# Altium project ALICE.PrjPCB
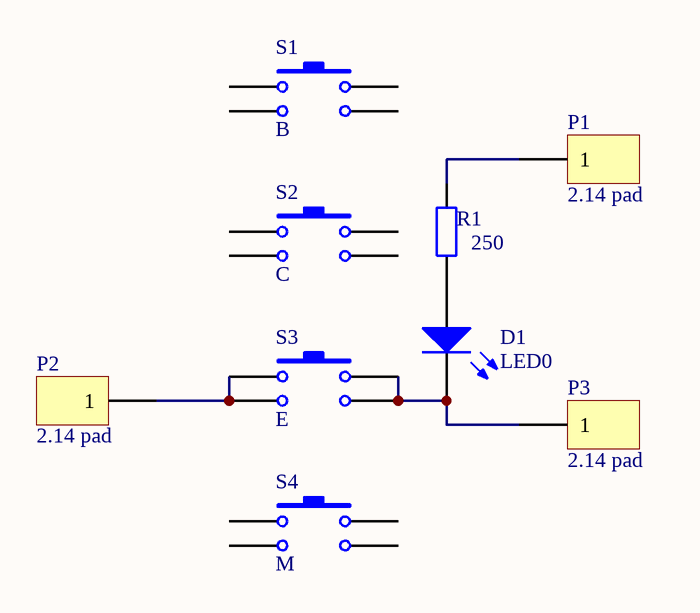
[diagram p0: plata_nizhn.SchDoc]
3 sheets, 44 parts. Net scope: global (net labels, ports and power ports of the same name join across sheets).
Board files: plata_nizhn.PcbDoc, plata_sredn.PcbDoc, plata_verhn.PcbDoc, print2.PcbDoc, print1.PcbDoc
Sheets:
  plata_nizhn.SchDoc
  plata_sredn.SchDoc
  plata_verhn.SchDoc

## Sheet plata_nizhn.SchDoc
size A4

### Parts
D1  LED0  [LED0805]
P1  2.14 pad  [Pad]
P2  2.14 pad  [Pad]
P3  2.14 pad  [Pad]
R1  250  [6-0805_N]
S1  B  [STMW]
S2  C  [STMW]
S3  E  [STMW]
S4  M  [STMW]

### Nets
NetD1_1: D1.1(A) R1.1
NetD1_2: D1.2(K) P3.1 S3.2
NetP1_1: P1.1 R1.2
NetP2_1: P2.1 S3.1

Not connected (* = marked no-connect by the designer): S1 1 2; S2 1 2; S4 1 2

### Library data of the parts
D1 = LED0: Typical INFRARED GaAs LED; Published: 8-Jun-2000; LatestRevisionDate: 08-Jul-2005; LatestRevisionNote: Mech Layer 1 removed.; PackageReference: LED-0; Publisher: Altium Limited; PackageDescription: LED; 2 Leads
P1-P3 = 2.14 pad: pad; LatestRevisionDate: 17-Jul-2002; LatestRevisionNote: Re-released for DXP Platform.; Publisher: Altium Limited
R1 = Res2: Resistor; Value: 1K; Published: 8-Jun-2000; LatestRevisionDate: 17-Jul-2002; LatestRevisionNote: Re-released for DXP Platform.; PackageReference: AXIAL-0.4; Publisher: Altium Limited; PackageDescription: Axial Device, Thru-Hole; 2 Leads; 0.4 in Pin Spacing
S1-S4 = STMW: Switch; Published: 24-Mar-1999; LatestRevisionDate: 17-Jul-2002; LatestRevisionNote: Re-released for DXP Platform.; PackageReference: SPST-2; Publisher: Altium Limited; PackageDescription: Switch; 2 Leads

## Sheet plata_sredn.SchDoc
size A4
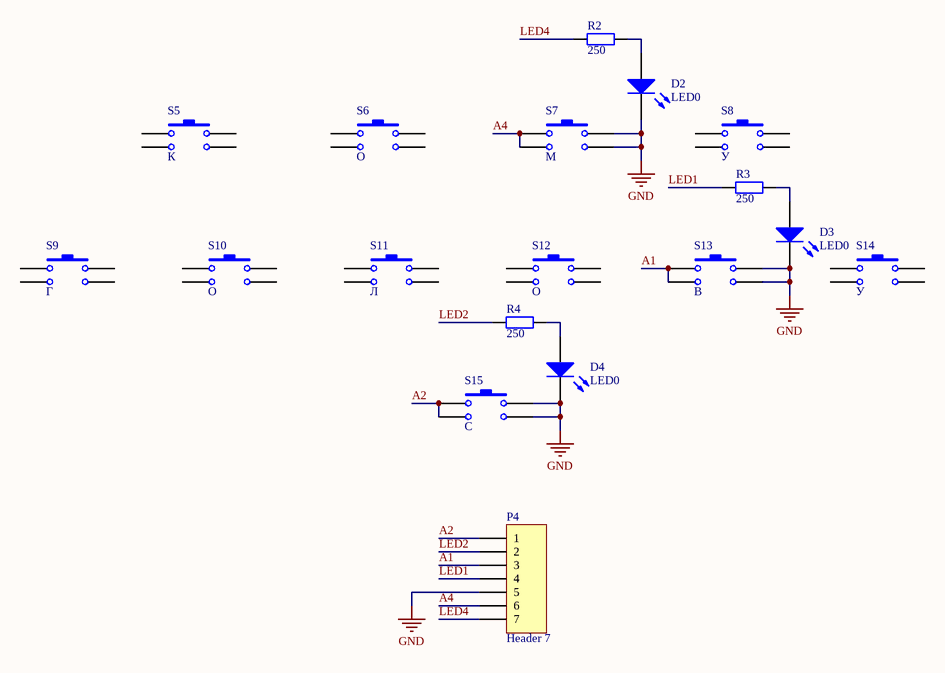
[diagram p1: plata_sredn.SchDoc]

### Parts
D2  LED0  [LED0805]
D3  LED0  [LED0805]
D4  LED0  [LED0805]
P4  Header 7  [HDR1X7]
R2  250  [6-0805_N]
R3  250  [6-0805_N]
R4  250  [6-0805_N]
S5  К  [STMW]
S6  О  [STMW]
S7  М  [STMW]
S8  У  [STMW]
S9  Г  [STMW]
S10  О  [STMW]
S11  Л  [STMW]
S12  О  [STMW]
S13  В  [STMW]
S14  У  [STMW]
S15  С  [STMW]

### Nets
GND: D2.2(K) D3.2(K) D4.2(K) P4.5 S7.2 S13.2 S15.2
A1: P4.3 S13.1
A2: P4.1 S15.1
A4: P4.6 S7.1
LED1: P4.4 R3.2
LED2: P4.2 R4.2
LED4: P4.7 R2.2
NetD2_1: D2.1(A) R2.1
NetD3_1: D3.1(A) R3.1
NetD4_1: D4.1(A) R4.1

Not connected (* = marked no-connect by the designer): S5 1 2; S6 1 2; S8 1 2; S9 1 2; S10 1 2; S11 1 2; S12 1 2; S14 1 2

### Library data of the parts
D2-D4 = LED0: Typical INFRARED GaAs LED; Published: 8-Jun-2000; LatestRevisionDate: 08-Jul-2005; LatestRevisionNote: Mech Layer 1 removed.; PackageReference: LED-0; Publisher: Altium Limited; PackageDescription: LED; 2 Leads
P4 = Header 7: Header, 7-Pin; LatestRevisionDate: 17-Jul-2002; LatestRevisionNote: Re-released for DXP Platform.; Publisher: Altium Limited
R2-R4 = Res2: Resistor; Value: 1K; Published: 8-Jun-2000; LatestRevisionDate: 17-Jul-2002; LatestRevisionNote: Re-released for DXP Platform.; PackageReference: AXIAL-0.4; Publisher: Altium Limited; PackageDescription: Axial Device, Thru-Hole; 2 Leads; 0.4 in Pin Spacing
S5-S15 = STMW: Switch; Published: 24-Mar-1999; LatestRevisionDate: 17-Jul-2002; LatestRevisionNote: Re-released for DXP Platform.; PackageReference: SPST-2; Publisher: Altium Limited; PackageDescription: Switch; 2 Leads

## Sheet plata_verhn.SchDoc
size A4
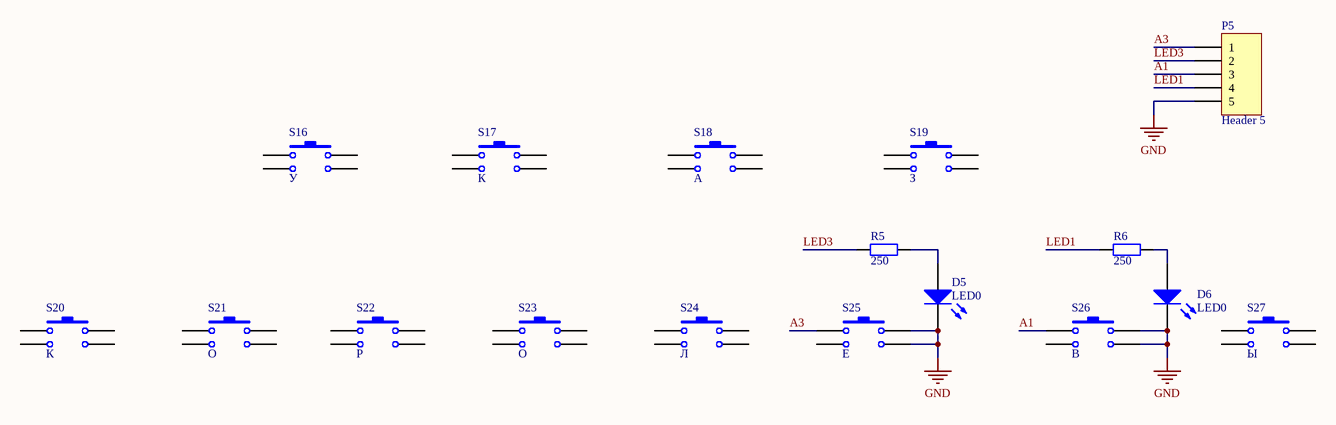
[diagram p2: plata_verhn.SchDoc]

### Parts
D5  LED0  [LED0805]
D6  LED0  [LED0805]
P5  Header 5  [HDR1X5]
R5  250  [6-0805_N]
R6  250  [6-0805_N]
S16  У  [STMW]
S17  К  [STMW]
S18  А  [STMW]
S19  З  [STMW]
S20  К  [STMW]
S21  О  [STMW]
S22  Р  [STMW]
S23  О  [STMW]
S24  Л  [STMW]
S25  Е  [STMW]
S26  В  [STMW]
S27  Ы  [STMW]

### Nets
GND: D5.2(K) D6.2(K) P5.5 S25.2 S26.2
A1: P5.3 S26.1
A3: P5.1 S25.1
LED1: P5.4 R6.2
LED3: P5.2 R5.2
NetD5_1: D5.1(A) R5.1
NetD6_1: D6.1(A) R6.1

Not connected (* = marked no-connect by the designer): S16 1 2; S17 1 2; S18 1 2; S19 1 2; S20 1 2; S21 1 2; S22 1 2; S23 1 2; S24 1 2; S27 1 2

### Library data of the parts
D5 D6 = LED0: Typical INFRARED GaAs LED; Published: 8-Jun-2000; LatestRevisionDate: 08-Jul-2005; LatestRevisionNote: Mech Layer 1 removed.; PackageReference: LED-0; Publisher: Altium Limited; PackageDescription: LED; 2 Leads
P5 = Header 5: Header, 5-Pin; LatestRevisionDate: 17-Jul-2002; LatestRevisionNote: Re-released for DXP Platform.; Publisher: Altium Limited
R5 R6 = Res2: Resistor; Value: 1K; Published: 8-Jun-2000; LatestRevisionDate: 17-Jul-2002; LatestRevisionNote: Re-released for DXP Platform.; PackageReference: AXIAL-0.4; Publisher: Altium Limited; PackageDescription: Axial Device, Thru-Hole; 2 Leads; 0.4 in Pin Spacing
S16-S27 = STMW: Switch; Published: 24-Mar-1999; LatestRevisionDate: 17-Jul-2002; LatestRevisionNote: Re-released for DXP Platform.; PackageReference: SPST-2; Publisher: Altium Limited; PackageDescription: Switch; 2 Leads

## Nets that join several sheets
GND: plata_sredn (7 pins), plata_verhn (5 pins)
A1: plata_sredn (P4.3 S13.1), plata_verhn (P5.3 S26.1)
LED1: plata_sredn (P4.4 R3.2), plata_verhn (P5.4 R6.2)